# EAGLE design 2 Port Memory (EAGLE 6.3)
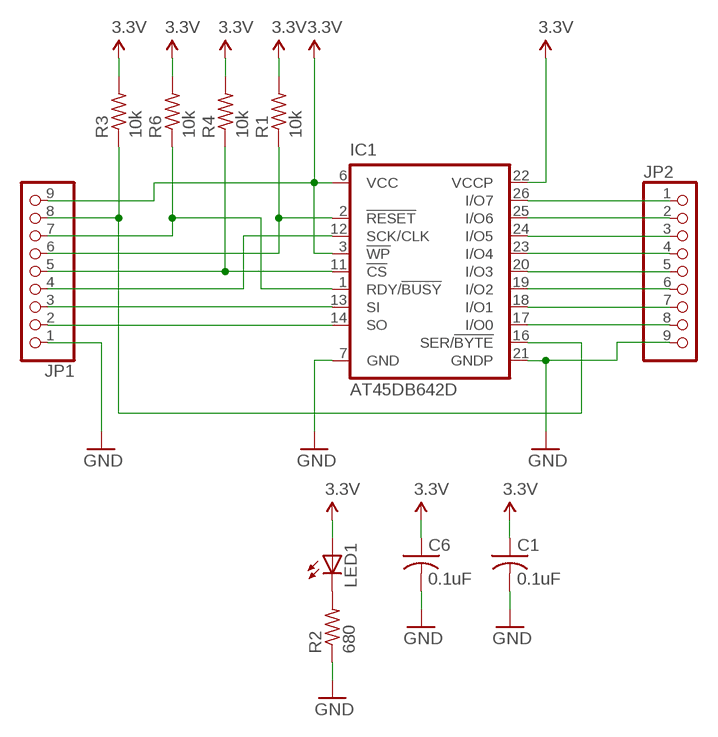
[diagram p0: schematic, sheet 1]

## Parts
C1  0.1uF  0603_CAP  [0603_RESISTOR]
C6  0.1uF  0603_CAP  [0603_RESISTOR]
IC1  AT45DB642D  [28T-TSOP-1]
JP1  PINHD-1X9  [1X09]
JP2  PINHD-1X9  [1X09]
LED1  LEDCHIP-LED0603  [CHIP-LED0603]
R1  10k  0603_RESISTOR  [0603_RESISTOR]
R2  680  0603_RESISTOR  [0603_RESISTOR]
R3  10k  0603_RESISTOR  [0603_RESISTOR]
R4  10k  0603_RESISTOR  [0603_RESISTOR]
R6  10k  0603_RESISTOR  [0603_RESISTOR]

## Nets
3.3V: C1.1 C6.1 IC1.3(!WP) IC1.6(VCC) IC1.22(VCCP) JP1.9 LED1.A R1.2 R3.2 R4.2 R6.2
GND: C1.2 C6.2 IC1.7(GND) IC1.21(GNDP) JP1.1 JP2.9 R2.1
N$1: IC1.1(RDY/!BUSY) JP1.7 R6.1
N$2: IC1.11(!CS) JP1.5 R4.1
N$3: IC1.12(SCK/CLK) JP1.4
N$4: LED1.C R2.2
N$5: IC1.16(SER/!BYTE) JP1.8 R3.1
N$6: IC1.17(I/O0) JP2.8
N$7: IC1.18(I/O1) JP2.7
N$8: IC1.19(I/O2) JP2.6
N$9: IC1.20(I/O3) JP2.5
N$10: IC1.23(I/O4) JP2.4
N$11: IC1.24(I/O5) JP2.3
N$12: IC1.25(I/O6) JP2.2
N$13: IC1.26(I/O7) JP2.1
N$14: IC1.14(SO) JP1.2
N$15: IC1.13(SI) JP1.3
N$16: IC1.2(!RESET) JP1.6 R1.1

## Library data of the parts
C1 C6 = jkf-parts:0603_CAP: 0603 Capacitor
IC1 = atmel:AT45DB642D: Flash-Memory 64-Megabit 2 .7-volt, Dual-interface, DataFlash Source: http://www.atmel.com/dyn/resources/prod_documents/doc3542.pdf; MPN: AT45DB642D-TU; OC_FARNELL: 1095799; OC_NEWARK: 51P1801
JP1 JP2 = pinhead:PINHD-1X9: PIN HEADER
LED1 = adafruit:LED: LED OSRAM: - CHIPLED LG R971, LG N971, LY N971, LG Q971, LY Q971, LO R971, LY R971 LH N974, LH R974 LS Q976, LO Q976, LY Q976 LO Q996 - Hyper CHIPLED LW Q18S LB Q993, LB Q99A, LB R99A - SideLED LS A670, LO A670, LY A670, LG A670, LP A670 LB A673, LV A673, LT A673, LW A673 LH A674 LY A675 LS A676, LA A676, LO A676, LY A676, LW A676 LS A679, LY A679, LG A679 - Hyper Micro SIDELED® LS Y876, LA Y876, LO Y876, LY Y876 LT Y87S - SmartLED LW L88C, LW L88S LB L89C, LB L89S, LG L890 LS L89K, LO L89K, LY L89K LS L896, LA L896, LO L896, LY L896 - TOPLED LS T670, LO T670, LY T670, LG T670, LP T670 LSG T670, LSP T670, LSY T670, LOP T670, LYG T670 LG T671, LOG T671, LSG T671 LB T673, LV T673, LT T673, LW T673 LH T674 LS T676, LA T676, LO T676, LY T676, LB T676, LH T676, LSB T676, LW T676 LB T67C, LV T67C, LT T67C, LS T67K, LO T67K, LY T67K, LW E67C LS E67B, LA E67B, LO E67B, LY E67B, LB E67C, LV E67C, LT E67C LW T67C LS T679, LY T679, LG T679 LS T770, LO T770, LY T770, LG T770, LP T770 LB T773, LV T773, LT T773, LW T773 LH T774 LS E675, LA E675, LY E675, LS T675 LS T776, LA T776, LO T776, LY T776, LB T776 LHGB T686 LT T68C, LB T68C - Hyper Mini TOPLED® LB M676 - Mini TOPLED Santana® LG M470 LS M47K, LO M47K, LY M47K Source: http://www.osram.convergy.de/
R1-R4 R6 = jkf-parts:0603_RESISTOR

## Board
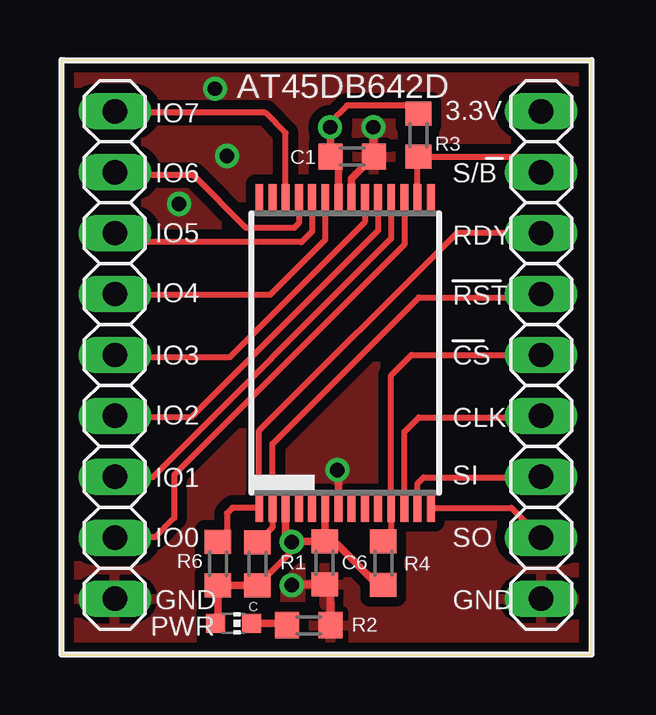
[diagram p1: board, top side]
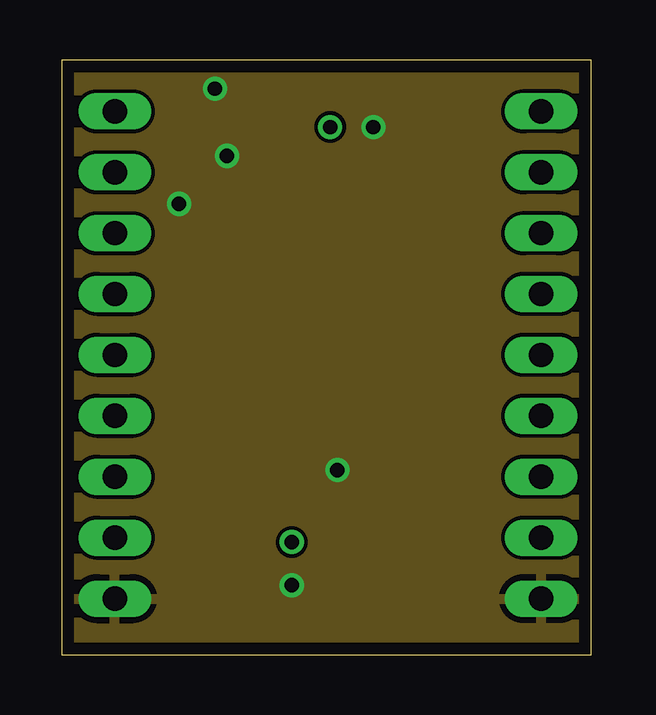
[diagram p2: board, inner layer GND]
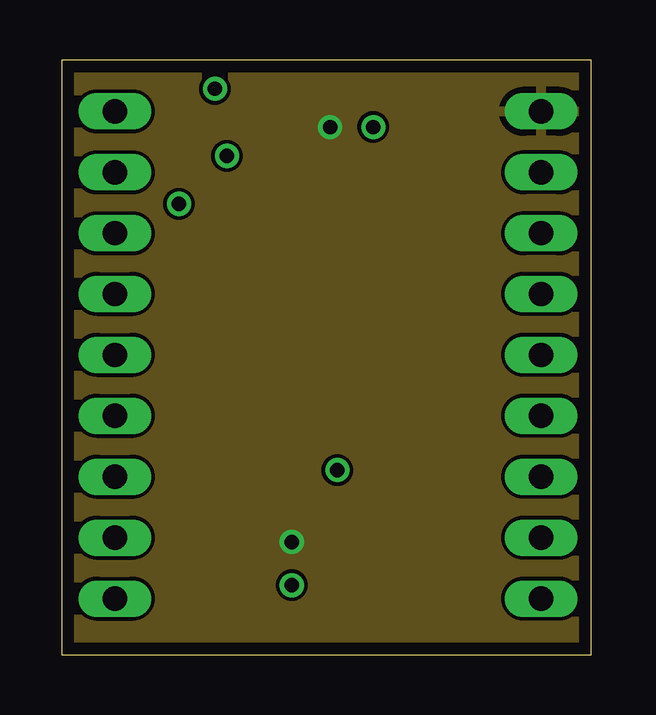
[diagram p3: board, inner layer 3.3V]
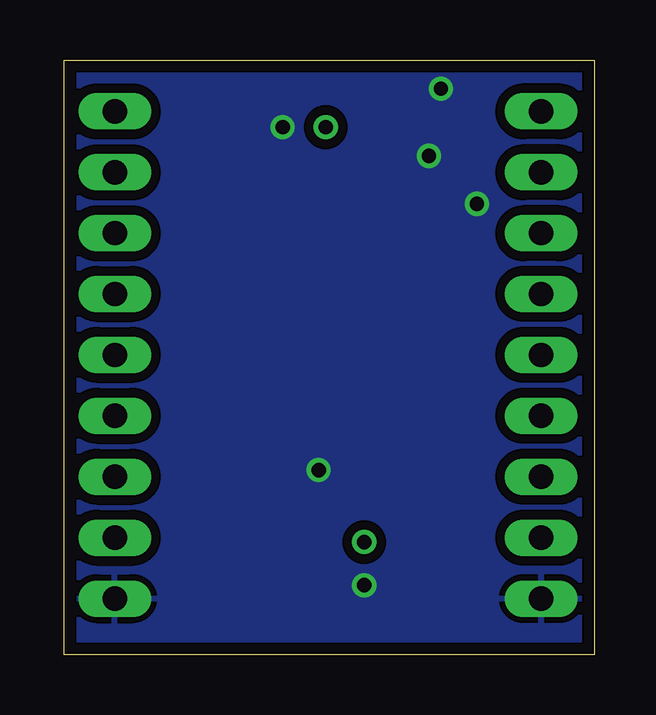
[diagram p4: board, bottom side, seen from below]

Size 22.1 x 24.8 mm. Coordinates in mm from the lower left corner, seen from the top.
Outline: 0,0 22.1,0 22.1,24.8 0,24.8 0,0
Copper layers (1+2*15+16): Top 0.0178mm / dielectric 12mil / GND 0.0356mm / dielectric 28mil / 3.3V 0.0356mm / dielectric 12mil / Bottom 0.0178mm
Design rules "SSC-EAGLE-4Lyr_v1.0.0.3": minimum track width 6mil, minimum drill 8mil, track to track 6mil, track to pad 6mil, pad to pad 6mil, via to via 6mil, smd to smd 6mil, copper to edge 20mil, drill to drill 16mil, minimum pad ring 8mil, minimum via ring 8mil, stop-mask expansion 3mil, vias tented up to drill 0mil, thermal gap 10mil

### Footprints (pad centres in the part's own frame; a part is rotated, then mirrored left to right if it is on the bottom)
0603_RESISTOR = smd 1 x 1.1: 1 -0.9,0; 2 0.9,0
28T-TSOP-1 = smd 1.2 x 0.33: 1 -6.45,3.575; 2 -6.45,3.025; 3 -6.45,2.475; 4 -6.45,1.925; 5 -6.45,1.375; 6 -6.45,0.825; 7 -6.45,0.275; 8 -6.45,-0.275; 9 -6.45,-0.825; 10 -6.45,-1.375; 11 -6.45,-1.925; 12 -6.45,-2.475; 13 -6.45,-3.025; 14 -6.45,-3.575; 15 6.45,-3.575; 16 6.45,-3.025; 17 6.45,-2.475; 18 6.45,-1.925; 19 6.45,-1.375; 20 6.45,-0.825; 21 6.45,-0.275; 22 6.45,0.275; 23 6.45,0.825; 24 6.45,1.375; 25 6.45,1.925; 26 6.45,2.475; 27 6.45,3.025; 28 6.45,3.575
1X09 = drill 1.016 long: 1 -10.16,0; 2 -7.62,0; 3 -5.08,0; 4 -2.54,0; 5 0,0; 6 2.54,0; 7 5.08,0; 8 7.62,0; 9 10.16,0
CHIP-LED0603 = smd 0.8 x 0.8: A 0,-0.75; C 0,0.75

### Placement (x,y rotation side)
C1  12.12,20.77 0 top
C6  10.97,3.83 270 top
IC1  11.82,12.58 90 top
JP1  20,12.5 90 top
JP2  2.22,12.5 270 top
LED1  7.17,1.31 270 top
R1  8.17,3.79 270 top
R2  10.31,1.23 180 top
R3  14.88,21.66 90 top
R4  13.42,3.82 270 top
R6  6.52,3.8 270 top

### Tracks (layer width: path | path; a pad name or v marks a point on that pad's centre or on a via)
3.3V  (via drill 0.6)
  Top 0.254: R1.2 9.6,4.32 v9.6,4.7 | R3.2 14.54,22.9 11.9,22.9 11.2,22.2 v11.2,22
  Top 0.305: IC1.6 10.99,4.75 C6.1 | C6.1 9.63,4.73 v9.6,4.7 9.35,4.96 IC1.3 | IC1.22 11.54,20.45 C1.1 11.22,21.98 v11.2,22 | C6.1 11.1,4.6 11.5,4.6 13.18,2.92 R4.2 13.52,2.82 | R1.2 R6.2 6.52,1.31 LED1.A
  pour 3.3V: -1,25 23,25 23,-1 -1,-1
GND  (via drill 0.6)
  Top 0.305: IC1.21 12.1,19.84 C1.2 13,20.79 v13,22 | IC1.7 11.54,7.66 v11.5,7.7 | v9.6,2.9 9.63,2.93 C6.2 11.21,2.93 R2.1
  other vias: 4.9,18.8 6.9,20.8 6.4,23.6
  pour GND: -1,25 23,25 23,-1 -1,-1
  pour Top (isolate 0.406): -1,25 23,25 23,-1 -1,-1
  pour Bottom (isolate 0.406): -1,25 23,25 23,-1 -1,-1
N$1
  Top 0.254: R6.1 6.9,5.08 6.9,5.9 7.13,6.13 IC1.1 8.24,9.35 16.5,17.6 19.98,17.6 JP1.7
N$2
  Top 0.254: JP1.5 14.6,12.5 13.74,11.64 IC1.11 13.74,5.04 R4.1
N$3
  Top 0.254: IC1.12 14.29,9.29 14.9,9.9 19.94,9.9 JP1.4
N$4
  Top 0.305: LED1.C 9.41,1.31 R2.2
N$5
  Top 0.254: IC1.16 14.85,20.73 R3.1 19.36,20.76 JP1.8
N$6
  Top 0.254: IC1.17 14.29,17.09 4.7,7.5 4.7,5.7 3.9,4.9 2.24,4.9 JP2.8
N$7
  Top 0.254: IC1.18 13.74,17.34 3.8,7.4 2.24,7.4 JP2.7
N$8
  Top 0.254: IC1.19 13.2,17.7 5.4,9.9 2.28,9.9 JP2.6
N$9
  Top 0.254: IC1.20 12.64,18.05 7,12.4 2.32,12.4 JP2.5
N$10
  Top 0.254: IC1.23 10.99,17.3 8.7,15 2.26,15 JP2.4
N$11
  Top 0.254: IC1.24 10.45,17.64 10,17.2 2.6,17.2 JP2.3
N$12
  Top 0.254: IC1.25 9.89,18 9.7,17.8 7.7,17.8 5.5,20 2.34,20 JP2.2
N$13
  Top 0.254: IC1.26 9.35,21.75 8.5,22.6 2.28,22.6 JP2.1
N$14
  Top 0.254: IC1.14 18.75,6.13 JP1.2
N$15
  Top 0.254: IC1.13 14.85,7.14 15.1,7.4 19.98,7.4 JP1.3
N$16
  Top 0.254: JP1.6 19.86,14.9 14.9,14.9 8.79,8.79 IC1.2 8.79,5.32 R1.1

### Text on the board
tPlace: C
tSilk: AT45DB642D | IO7 | 3.3V | IO6 | S/B | IO5 | RDY | IO4 | RST | IO3 | CS | IO2 | CLK | IO1 | SI | IO0 | SO | GND | GND | PWR